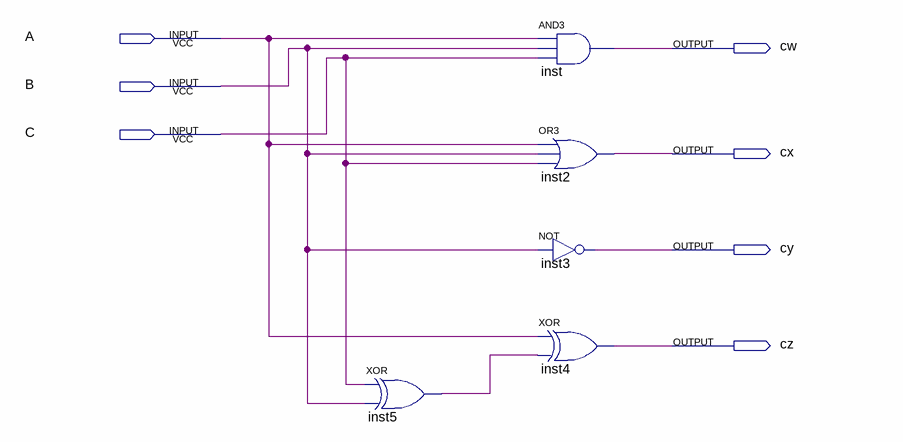
[diagram p0: schematic sheet]
// Quartus schematic Ejercicio8.bdf as structural Verilog: 5 symbols, 7 pins
module Ejercicio8 (
  input  A,
  input  B,
  input  C,
  output cw,
  output cx,
  output cy,
  output cz
);

  wire inst5_out;

  xor inst5 (inst5_out, C, B);
  and inst (cw, A, B, C);
  or inst2 (cx, A, B, C);
  not inst3 (cy, B);
  xor inst4 (cz, A, inst5_out);
endmodule
